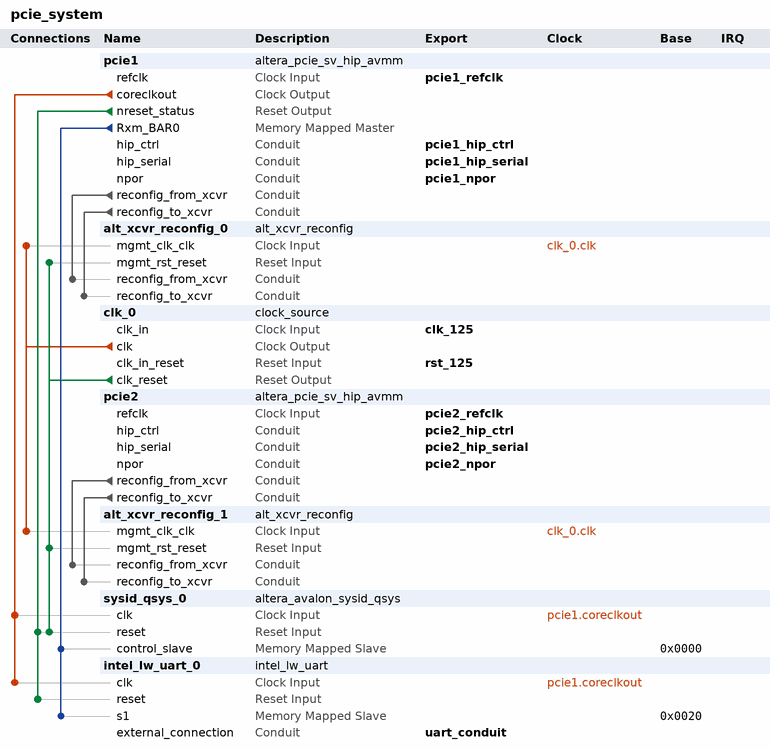
[diagram p0: system contents]
# Platform Designer (Qsys) system pcie_system, Stratix V 5SEE9F45C2
# Parameters at their usual value, and those the tool derives, are not listed.
package require -exact qsys 23.1
create_system pcie_system
set_project_property DEVICE_FAMILY {Stratix V}
set_project_property DEVICE 5SEE9F45C2

add_instance pcie1 altera_pcie_sv_hip_avmm 23.1
set_instance_parameter_value pcie1 AST_LITE 0
set_instance_parameter_value pcie1 AVALON_ADDR_WIDTH 32
set_instance_parameter_value pcie1 AddressPage "0\\,1\\,2\\,3\\,4\\,5\\,6\\,7\\,8\\,9\\,10\\,11\\,12\\,13\\,14\\,15"
set_instance_parameter_value pcie1 BYPASSS_A2P_TRANSLATION 0
set_instance_parameter_value pcie1 CB_A2P_ADDR_MAP_FIXED_TABLE_0_HIGH 0
set_instance_parameter_value pcie1 CB_A2P_ADDR_MAP_FIXED_TABLE_0_LOW 0
set_instance_parameter_value pcie1 CB_A2P_ADDR_MAP_FIXED_TABLE_10_HIGH 0
set_instance_parameter_value pcie1 CB_A2P_ADDR_MAP_FIXED_TABLE_10_LOW 0
set_instance_parameter_value pcie1 CB_A2P_ADDR_MAP_FIXED_TABLE_11_HIGH 0
set_instance_parameter_value pcie1 CB_A2P_ADDR_MAP_FIXED_TABLE_11_LOW 0
set_instance_parameter_value pcie1 CB_A2P_ADDR_MAP_FIXED_TABLE_12_HIGH 0
set_instance_parameter_value pcie1 CB_A2P_ADDR_MAP_FIXED_TABLE_12_LOW 0
set_instance_parameter_value pcie1 CB_A2P_ADDR_MAP_FIXED_TABLE_13_HIGH 0
set_instance_parameter_value pcie1 CB_A2P_ADDR_MAP_FIXED_TABLE_13_LOW 0
set_instance_parameter_value pcie1 CB_A2P_ADDR_MAP_FIXED_TABLE_14_HIGH 0
set_instance_parameter_value pcie1 CB_A2P_ADDR_MAP_FIXED_TABLE_14_LOW 0
set_instance_parameter_value pcie1 CB_A2P_ADDR_MAP_FIXED_TABLE_15_HIGH 0
set_instance_parameter_value pcie1 CB_A2P_ADDR_MAP_FIXED_TABLE_15_LOW 0
set_instance_parameter_value pcie1 CB_A2P_ADDR_MAP_FIXED_TABLE_1_HIGH 0
set_instance_parameter_value pcie1 CB_A2P_ADDR_MAP_FIXED_TABLE_1_LOW 0
set_instance_parameter_value pcie1 CB_A2P_ADDR_MAP_FIXED_TABLE_2_HIGH 0
set_instance_parameter_value pcie1 CB_A2P_ADDR_MAP_FIXED_TABLE_2_LOW 0
set_instance_parameter_value pcie1 CB_A2P_ADDR_MAP_FIXED_TABLE_3_HIGH 0
set_instance_parameter_value pcie1 CB_A2P_ADDR_MAP_FIXED_TABLE_3_LOW 0
set_instance_parameter_value pcie1 CB_A2P_ADDR_MAP_FIXED_TABLE_4_HIGH 0
set_instance_parameter_value pcie1 CB_A2P_ADDR_MAP_FIXED_TABLE_4_LOW 0
set_instance_parameter_value pcie1 CB_A2P_ADDR_MAP_FIXED_TABLE_5_HIGH 0
set_instance_parameter_value pcie1 CB_A2P_ADDR_MAP_FIXED_TABLE_5_LOW 0
set_instance_parameter_value pcie1 CB_A2P_ADDR_MAP_FIXED_TABLE_6_HIGH 0
set_instance_parameter_value pcie1 CB_A2P_ADDR_MAP_FIXED_TABLE_6_LOW 0
set_instance_parameter_value pcie1 CB_A2P_ADDR_MAP_FIXED_TABLE_7_HIGH 0
set_instance_parameter_value pcie1 CB_A2P_ADDR_MAP_FIXED_TABLE_7_LOW 0
set_instance_parameter_value pcie1 CB_A2P_ADDR_MAP_FIXED_TABLE_8_HIGH 0
set_instance_parameter_value pcie1 CB_A2P_ADDR_MAP_FIXED_TABLE_8_LOW 0
set_instance_parameter_value pcie1 CB_A2P_ADDR_MAP_FIXED_TABLE_9_HIGH 0
set_instance_parameter_value pcie1 CB_A2P_ADDR_MAP_FIXED_TABLE_9_LOW 0
set_instance_parameter_value pcie1 CB_A2P_ADDR_MAP_IS_FIXED 0
set_instance_parameter_value pcie1 CB_A2P_ADDR_MAP_NUM_ENTRIES 2
set_instance_parameter_value pcie1 CB_A2P_ADDR_MAP_PASS_THRU_BITS 20
set_instance_parameter_value pcie1 CB_P2A_AVALON_ADDR_B0 0x00000000
set_instance_parameter_value pcie1 CB_P2A_AVALON_ADDR_B1 0x00000000
set_instance_parameter_value pcie1 CB_P2A_AVALON_ADDR_B2 0x00000000
set_instance_parameter_value pcie1 CB_P2A_AVALON_ADDR_B3 0x00000000
set_instance_parameter_value pcie1 CB_P2A_AVALON_ADDR_B4 0x00000000
set_instance_parameter_value pcie1 CB_P2A_AVALON_ADDR_B5 0x00000000
set_instance_parameter_value pcie1 CB_P2A_FIXED_AVALON_ADDR_B0 0
set_instance_parameter_value pcie1 CB_P2A_FIXED_AVALON_ADDR_B1 0
set_instance_parameter_value pcie1 CB_P2A_FIXED_AVALON_ADDR_B2 0
set_instance_parameter_value pcie1 CB_P2A_FIXED_AVALON_ADDR_B3 0
set_instance_parameter_value pcie1 CB_P2A_FIXED_AVALON_ADDR_B4 0
set_instance_parameter_value pcie1 CB_P2A_FIXED_AVALON_ADDR_B5 0
set_instance_parameter_value pcie1 CB_PCIE_MODE 1
set_instance_parameter_value pcie1 CB_PCIE_RX_LITE 0
set_instance_parameter_value pcie1 CB_RP_S_ADDR_WIDTH 32
set_instance_parameter_value pcie1 CG_COMMON_CLOCK_MODE 1
set_instance_parameter_value pcie1 CG_ENABLE_A2P_INTERRUPT 0
set_instance_parameter_value pcie1 CG_ENABLE_ADVANCED_INTERRUPT 0
set_instance_parameter_value pcie1 CG_ENABLE_HIP_STATUS 1
set_instance_parameter_value pcie1 CG_ENABLE_HIP_STATUS_EXTENSION 0
set_instance_parameter_value pcie1 CG_IMPL_CRA_AV_SLAVE_PORT 0
set_instance_parameter_value pcie1 CG_RXM_IRQ_NUM 16
set_instance_parameter_value pcie1 NUM_PREFETCH_MASTERS 1
set_instance_parameter_value pcie1 PCIeAddress31_0 "0x00000000\\,0x00000000\\,0x00000000\\,0x00000000\\,0x00000000\\,0x00000000\\,0x00000000\\,0x00000000\\,0x00000000\\,0x00000000\\,0x00000000\\,0x00000000\\,0x00000000\\,0x00000000\\,0x00000000\\,0x00000000"
set_instance_parameter_value pcie1 PCIeAddress63_32 "0x00000000\\,0x00000000\\,0x00000000\\,0x00000000\\,0x00000000\\,0x00000000\\,0x00000000\\,0x00000000\\,0x00000000\\,0x00000000\\,0x00000000\\,0x00000000\\,0x00000000\\,0x00000000\\,0x00000000\\,0x00000000"
set_instance_parameter_value pcie1 RXM_BEN_WIDTH 8
set_instance_parameter_value pcie1 RXM_DATA_WIDTH 64
set_instance_parameter_value pcie1 SLAVE_ADDRESS_MAP_0 6
set_instance_parameter_value pcie1 SLAVE_ADDRESS_MAP_1 0
set_instance_parameter_value pcie1 SLAVE_ADDRESS_MAP_2 0
set_instance_parameter_value pcie1 SLAVE_ADDRESS_MAP_3 0
set_instance_parameter_value pcie1 SLAVE_ADDRESS_MAP_4 0
set_instance_parameter_value pcie1 SLAVE_ADDRESS_MAP_5 0
set_instance_parameter_value pcie1 TX_S_ADDR_WIDTH 32
set_instance_parameter_value pcie1 advanced_default_hwtcl_atomic_malformed true
set_instance_parameter_value pcie1 advanced_default_hwtcl_atomic_op_completer_32bit false
set_instance_parameter_value pcie1 advanced_default_hwtcl_atomic_op_completer_64bit false
set_instance_parameter_value pcie1 advanced_default_hwtcl_atomic_op_routing false
set_instance_parameter_value pcie1 advanced_default_hwtcl_bridge_port_ssid_support false
set_instance_parameter_value pcie1 advanced_default_hwtcl_bridge_port_vga_enable false
set_instance_parameter_value pcie1 advanced_default_hwtcl_bypass_cdc false
set_instance_parameter_value pcie1 advanced_default_hwtcl_cas_completer_128bit false
set_instance_parameter_value pcie1 advanced_default_hwtcl_cdc_dummy_insert_limit 11
set_instance_parameter_value pcie1 advanced_default_hwtcl_d0_pme false
set_instance_parameter_value pcie1 advanced_default_hwtcl_d1_pme false
set_instance_parameter_value pcie1 advanced_default_hwtcl_d1_support false
set_instance_parameter_value pcie1 advanced_default_hwtcl_d2_pme false
set_instance_parameter_value pcie1 advanced_default_hwtcl_d2_support false
set_instance_parameter_value pcie1 advanced_default_hwtcl_d3_cold_pme false
set_instance_parameter_value pcie1 advanced_default_hwtcl_d3_hot_pme false
set_instance_parameter_value pcie1 advanced_default_hwtcl_data_pack_rx disable
set_instance_parameter_value pcie1 advanced_default_hwtcl_deskew_comma com_deskw
set_instance_parameter_value pcie1 advanced_default_hwtcl_device_number 0
set_instance_parameter_value pcie1 advanced_default_hwtcl_disable_link_x2_support false
set_instance_parameter_value pcie1 advanced_default_hwtcl_disable_snoop_packet false
set_instance_parameter_value pcie1 advanced_default_hwtcl_ei_delay_powerdown_count 10
set_instance_parameter_value pcie1 advanced_default_hwtcl_eie_before_nfts_count 4
set_instance_parameter_value pcie1 advanced_default_hwtcl_enable_adapter_half_rate_mode false
set_instance_parameter_value pcie1 advanced_default_hwtcl_enable_l1_aspm false
set_instance_parameter_value pcie1 advanced_default_hwtcl_enable_rx_buffer_checking false
set_instance_parameter_value pcie1 advanced_default_hwtcl_extended_format_field false
set_instance_parameter_value pcie1 advanced_default_hwtcl_extended_tag_reset false
set_instance_parameter_value pcie1 advanced_default_hwtcl_fc_init_timer 1024
set_instance_parameter_value pcie1 advanced_default_hwtcl_flow_control_timeout_count 200
set_instance_parameter_value pcie1 advanced_default_hwtcl_flow_control_update_count 30
set_instance_parameter_value pcie1 advanced_default_hwtcl_flr_capability false
set_instance_parameter_value pcie1 advanced_default_hwtcl_gen2_diffclock_nfts_count 255
set_instance_parameter_value pcie1 advanced_default_hwtcl_gen2_sameclock_nfts_count 255
set_instance_parameter_value pcie1 advanced_default_hwtcl_hot_plug_support 0
set_instance_parameter_value pcie1 advanced_default_hwtcl_interrupt_pin inta
set_instance_parameter_value pcie1 advanced_default_hwtcl_l01_entry_latency 31
set_instance_parameter_value pcie1 advanced_default_hwtcl_l0_exit_latency_diffclock 6
set_instance_parameter_value pcie1 advanced_default_hwtcl_l0_exit_latency_sameclock 6
set_instance_parameter_value pcie1 advanced_default_hwtcl_l1_exit_latency_diffclock 0
set_instance_parameter_value pcie1 advanced_default_hwtcl_l1_exit_latency_sameclock 0
set_instance_parameter_value pcie1 advanced_default_hwtcl_low_priority_vc single_vc
set_instance_parameter_value pcie1 advanced_default_hwtcl_ltr_mechanism false
set_instance_parameter_value pcie1 advanced_default_hwtcl_ltssm_1ms_timeout disable
set_instance_parameter_value pcie1 advanced_default_hwtcl_ltssm_freqlocked_check disable
set_instance_parameter_value pcie1 advanced_default_hwtcl_maximum_current 0
set_instance_parameter_value pcie1 advanced_default_hwtcl_no_command_completed false
set_instance_parameter_value pcie1 advanced_default_hwtcl_no_soft_reset false
set_instance_parameter_value pcie1 advanced_default_hwtcl_pclk_out_sel pclk
set_instance_parameter_value pcie1 advanced_default_hwtcl_pipex1_debug_sel disable
set_instance_parameter_value pcie1 advanced_default_hwtcl_register_pipe_signals false
set_instance_parameter_value pcie1 advanced_default_hwtcl_reserved_debug 0
set_instance_parameter_value pcie1 advanced_default_hwtcl_retry_buffer_last_active_address 2047
set_instance_parameter_value pcie1 advanced_default_hwtcl_rx_l0s_count_idl 0
set_instance_parameter_value pcie1 advanced_default_hwtcl_set_l0s 0
set_instance_parameter_value pcie1 advanced_default_hwtcl_skp_os_gen3_count 0
set_instance_parameter_value pcie1 advanced_default_hwtcl_skp_os_schedule_count 0
set_instance_parameter_value pcie1 advanced_default_hwtcl_ssid 0
set_instance_parameter_value pcie1 advanced_default_hwtcl_ssvid 0
set_instance_parameter_value pcie1 advanced_default_hwtcl_tph_completer false
set_instance_parameter_value pcie1 advanced_default_hwtcl_tx_cdc_almost_empty 5
set_instance_parameter_value pcie1 advanced_default_hwtcl_vc0_clk_enable true
set_instance_parameter_value pcie1 advanced_default_hwtcl_wrong_device_id disable
set_instance_parameter_value pcie1 advanced_default_parameter_override 0
set_instance_parameter_value pcie1 avmm_width_hwtcl 128
set_instance_parameter_value pcie1 bar0_type_hwtcl 2
set_instance_parameter_value pcie1 bar1_type_hwtcl 0
set_instance_parameter_value pcie1 bar2_type_hwtcl 0
set_instance_parameter_value pcie1 bar3_type_hwtcl 0
set_instance_parameter_value pcie1 bar4_type_hwtcl 0
set_instance_parameter_value pcie1 bar5_type_hwtcl 0
set_instance_parameter_value pcie1 bypass_tl false
set_instance_parameter_value pcie1 class_code_hwtcl 0
set_instance_parameter_value pcie1 completion_timeout_hwtcl ABCD
set_instance_parameter_value pcie1 device_id_hwtcl 167
set_instance_parameter_value pcie1 dll_active_report_support_hwtcl 0
set_instance_parameter_value pcie1 ecrc_check_capable_hwtcl 0
set_instance_parameter_value pcie1 ecrc_gen_capable_hwtcl 0
set_instance_parameter_value pcie1 enable_completion_timeout_disable_hwtcl 1
set_instance_parameter_value pcie1 enable_function_msix_support_hwtcl 0
set_instance_parameter_value pcie1 enable_pcisigtest_hwtcl 0
set_instance_parameter_value pcie1 enable_power_on_rst_pulse_hwtcl 0
set_instance_parameter_value pcie1 enable_slot_register_hwtcl 0
set_instance_parameter_value pcie1 enable_tl_only_sim_hwtcl 0
set_instance_parameter_value pcie1 endpoint_l0_latency_hwtcl 0
set_instance_parameter_value pcie1 endpoint_l1_latency_hwtcl 0
set_instance_parameter_value pcie1 expansion_base_address_register_hwtcl 0
set_instance_parameter_value pcie1 extend_tag_field_hwtcl 32
set_instance_parameter_value pcie1 fixed_address_mode 0
set_instance_parameter_value pcie1 force_hrc 0
set_instance_parameter_value pcie1 force_src 0
set_instance_parameter_value pcie1 gen123_lane_rate_mode_hwtcl {Gen2 (5.0 Gbps)}
set_instance_parameter_value pcie1 gen3_rxfreqlock_counter_hwtcl 0
set_instance_parameter_value pcie1 hip_reconfig_hwtcl 0
set_instance_parameter_value pcie1 hip_tag_checking_hwtcl 1
set_instance_parameter_value pcie1 hwtcl_override_g2_txvod 1
set_instance_parameter_value pcie1 in_cvp_mode_hwtcl 0
set_instance_parameter_value pcie1 io_window_addr_width_hwtcl 0
set_instance_parameter_value pcie1 lane_mask_hwtcl x8
set_instance_parameter_value pcie1 max_payload_size_hwtcl 128
set_instance_parameter_value pcie1 msi_64bit_addressing_capable_hwtcl true
set_instance_parameter_value pcie1 msi_masking_capable_hwtcl false
set_instance_parameter_value pcie1 msi_multi_message_capable_hwtcl 4
set_instance_parameter_value pcie1 msi_support_hwtcl true
set_instance_parameter_value pcie1 msix_pba_bir_hwtcl 0
set_instance_parameter_value pcie1 msix_pba_offset_hwtcl 0
set_instance_parameter_value pcie1 msix_table_bir_hwtcl 0
set_instance_parameter_value pcie1 msix_table_offset_hwtcl 0
set_instance_parameter_value pcie1 msix_table_size_hwtcl 0
set_instance_parameter_value pcie1 override_rxbuffer_cred_preset 0
set_instance_parameter_value pcie1 override_tbpartner_driver_setting_hwtcl 0
set_instance_parameter_value pcie1 pcie_inspector_hwtcl 0
set_instance_parameter_value pcie1 pcie_qsys 1
set_instance_parameter_value pcie1 pll_refclk_freq_hwtcl {100 MHz}
set_instance_parameter_value pcie1 port_link_number_hwtcl 1
set_instance_parameter_value pcie1 port_type_hwtcl {Native endpoint}
set_instance_parameter_value pcie1 prefetchable_mem_window_addr_width_hwtcl 0
set_instance_parameter_value pcie1 revision_id_hwtcl 1
set_instance_parameter_value pcie1 rpre_emph_a_val_hwtcl 9
set_instance_parameter_value pcie1 rpre_emph_b_val_hwtcl 0
set_instance_parameter_value pcie1 rpre_emph_c_val_hwtcl 16
set_instance_parameter_value pcie1 rpre_emph_d_val_hwtcl 13
set_instance_parameter_value pcie1 rpre_emph_e_val_hwtcl 5
set_instance_parameter_value pcie1 rvod_sel_a_val_hwtcl 42
set_instance_parameter_value pcie1 rvod_sel_b_val_hwtcl 38
set_instance_parameter_value pcie1 rvod_sel_c_val_hwtcl 38
set_instance_parameter_value pcie1 rvod_sel_d_val_hwtcl 43
set_instance_parameter_value pcie1 rvod_sel_e_val_hwtcl 15
set_instance_parameter_value pcie1 rxbuffer_rxreq_hwtcl Low
set_instance_parameter_value pcie1 serial_sim_hwtcl 1
set_instance_parameter_value pcie1 set_pld_clk_x1_625MHz_hwtcl 0
set_instance_parameter_value pcie1 slot_number_hwtcl 0
set_instance_parameter_value pcie1 slot_power_limit_hwtcl 0
set_instance_parameter_value pcie1 slot_power_scale_hwtcl 0
set_instance_parameter_value pcie1 slotclkcfg_hwtcl 1
set_instance_parameter_value pcie1 subsystem_device_id_hwtcl 1
set_instance_parameter_value pcie1 subsystem_vendor_id_hwtcl 418
set_instance_parameter_value pcie1 surprise_down_error_support_hwtcl 0
set_instance_parameter_value pcie1 tlp_insp_trg_dw0_hwtcl 2049
set_instance_parameter_value pcie1 tlp_insp_trg_dw1_hwtcl 0
set_instance_parameter_value pcie1 tlp_insp_trg_dw2_hwtcl 0
set_instance_parameter_value pcie1 tlp_insp_trg_dw3_hwtcl 0
set_instance_parameter_value pcie1 tlp_inspector_hwtcl 0
set_instance_parameter_value pcie1 tlp_inspector_use_signal_probe_hwtcl 0
set_instance_parameter_value pcie1 use_aer_hwtcl 0
set_instance_parameter_value pcie1 use_ast_parity 0
set_instance_parameter_value pcie1 use_atx_pll_hwtcl 0
set_instance_parameter_value pcie1 use_crc_forwarding_hwtcl 0
set_instance_parameter_value pcie1 use_cvp_update_core_pof_hwtcl 0
set_instance_parameter_value pcie1 use_rx_st_be_hwtcl 0
set_instance_parameter_value pcie1 user_id_hwtcl 0
set_instance_parameter_value pcie1 vendor_id_hwtcl 4466
set_instance_parameter_value pcie1 vsec_id_hwtcl 4466
set_instance_parameter_value pcie1 vsec_rev_hwtcl 0

add_instance alt_xcvr_reconfig_0 alt_xcvr_reconfig 19.1
set_instance_parameter_value alt_xcvr_reconfig_0 device_family {Stratix V}
set_instance_parameter_value alt_xcvr_reconfig_0 enable_adce 0
set_instance_parameter_value alt_xcvr_reconfig_0 enable_analog 1
set_instance_parameter_value alt_xcvr_reconfig_0 number_of_reconfig_interfaces 10

add_instance clk_0 clock_source 23.1
set_instance_parameter_value clk_0 clockFrequency 125000000

add_instance pcie2 altera_pcie_sv_hip_avmm 23.1
set_instance_parameter_value pcie2 AST_LITE 0
set_instance_parameter_value pcie2 AVALON_ADDR_WIDTH 32
set_instance_parameter_value pcie2 AddressPage "0\\,1\\,2\\,3\\,4\\,5\\,6\\,7\\,8\\,9\\,10\\,11\\,12\\,13\\,14\\,15"
set_instance_parameter_value pcie2 BYPASSS_A2P_TRANSLATION 0
set_instance_parameter_value pcie2 CB_A2P_ADDR_MAP_FIXED_TABLE_0_HIGH 0
set_instance_parameter_value pcie2 CB_A2P_ADDR_MAP_FIXED_TABLE_0_LOW 0
set_instance_parameter_value pcie2 CB_A2P_ADDR_MAP_FIXED_TABLE_10_HIGH 0
set_instance_parameter_value pcie2 CB_A2P_ADDR_MAP_FIXED_TABLE_10_LOW 0
set_instance_parameter_value pcie2 CB_A2P_ADDR_MAP_FIXED_TABLE_11_HIGH 0
set_instance_parameter_value pcie2 CB_A2P_ADDR_MAP_FIXED_TABLE_11_LOW 0
set_instance_parameter_value pcie2 CB_A2P_ADDR_MAP_FIXED_TABLE_12_HIGH 0
set_instance_parameter_value pcie2 CB_A2P_ADDR_MAP_FIXED_TABLE_12_LOW 0
set_instance_parameter_value pcie2 CB_A2P_ADDR_MAP_FIXED_TABLE_13_HIGH 0
set_instance_parameter_value pcie2 CB_A2P_ADDR_MAP_FIXED_TABLE_13_LOW 0
set_instance_parameter_value pcie2 CB_A2P_ADDR_MAP_FIXED_TABLE_14_HIGH 0
set_instance_parameter_value pcie2 CB_A2P_ADDR_MAP_FIXED_TABLE_14_LOW 0
set_instance_parameter_value pcie2 CB_A2P_ADDR_MAP_FIXED_TABLE_15_HIGH 0
set_instance_parameter_value pcie2 CB_A2P_ADDR_MAP_FIXED_TABLE_15_LOW 0
set_instance_parameter_value pcie2 CB_A2P_ADDR_MAP_FIXED_TABLE_1_HIGH 0
set_instance_parameter_value pcie2 CB_A2P_ADDR_MAP_FIXED_TABLE_1_LOW 0
set_instance_parameter_value pcie2 CB_A2P_ADDR_MAP_FIXED_TABLE_2_HIGH 0
set_instance_parameter_value pcie2 CB_A2P_ADDR_MAP_FIXED_TABLE_2_LOW 0
set_instance_parameter_value pcie2 CB_A2P_ADDR_MAP_FIXED_TABLE_3_HIGH 0
set_instance_parameter_value pcie2 CB_A2P_ADDR_MAP_FIXED_TABLE_3_LOW 0
set_instance_parameter_value pcie2 CB_A2P_ADDR_MAP_FIXED_TABLE_4_HIGH 0
set_instance_parameter_value pcie2 CB_A2P_ADDR_MAP_FIXED_TABLE_4_LOW 0
set_instance_parameter_value pcie2 CB_A2P_ADDR_MAP_FIXED_TABLE_5_HIGH 0
set_instance_parameter_value pcie2 CB_A2P_ADDR_MAP_FIXED_TABLE_5_LOW 0
set_instance_parameter_value pcie2 CB_A2P_ADDR_MAP_FIXED_TABLE_6_HIGH 0
set_instance_parameter_value pcie2 CB_A2P_ADDR_MAP_FIXED_TABLE_6_LOW 0
set_instance_parameter_value pcie2 CB_A2P_ADDR_MAP_FIXED_TABLE_7_HIGH 0
set_instance_parameter_value pcie2 CB_A2P_ADDR_MAP_FIXED_TABLE_7_LOW 0
set_instance_parameter_value pcie2 CB_A2P_ADDR_MAP_FIXED_TABLE_8_HIGH 0
set_instance_parameter_value pcie2 CB_A2P_ADDR_MAP_FIXED_TABLE_8_LOW 0
set_instance_parameter_value pcie2 CB_A2P_ADDR_MAP_FIXED_TABLE_9_HIGH 0
set_instance_parameter_value pcie2 CB_A2P_ADDR_MAP_FIXED_TABLE_9_LOW 0
set_instance_parameter_value pcie2 CB_A2P_ADDR_MAP_IS_FIXED 0
set_instance_parameter_value pcie2 CB_A2P_ADDR_MAP_NUM_ENTRIES 2
set_instance_parameter_value pcie2 CB_A2P_ADDR_MAP_PASS_THRU_BITS 20
set_instance_parameter_value pcie2 CB_P2A_AVALON_ADDR_B0 0x00000000
set_instance_parameter_value pcie2 CB_P2A_AVALON_ADDR_B1 0x00000000
set_instance_parameter_value pcie2 CB_P2A_AVALON_ADDR_B2 0x00000000
set_instance_parameter_value pcie2 CB_P2A_AVALON_ADDR_B3 0x00000000
set_instance_parameter_value pcie2 CB_P2A_AVALON_ADDR_B4 0x00000000
set_instance_parameter_value pcie2 CB_P2A_AVALON_ADDR_B5 0x00000000
set_instance_parameter_value pcie2 CB_P2A_FIXED_AVALON_ADDR_B0 0
set_instance_parameter_value pcie2 CB_P2A_FIXED_AVALON_ADDR_B1 0
set_instance_parameter_value pcie2 CB_P2A_FIXED_AVALON_ADDR_B2 0
set_instance_parameter_value pcie2 CB_P2A_FIXED_AVALON_ADDR_B3 0
set_instance_parameter_value pcie2 CB_P2A_FIXED_AVALON_ADDR_B4 0
set_instance_parameter_value pcie2 CB_P2A_FIXED_AVALON_ADDR_B5 0
set_instance_parameter_value pcie2 CB_PCIE_MODE 1
set_instance_parameter_value pcie2 CB_PCIE_RX_LITE 0
set_instance_parameter_value pcie2 CB_RP_S_ADDR_WIDTH 32
set_instance_parameter_value pcie2 CG_COMMON_CLOCK_MODE 1
set_instance_parameter_value pcie2 CG_ENABLE_A2P_INTERRUPT 0
set_instance_parameter_value pcie2 CG_ENABLE_ADVANCED_INTERRUPT 0
set_instance_parameter_value pcie2 CG_ENABLE_HIP_STATUS 1
set_instance_parameter_value pcie2 CG_ENABLE_HIP_STATUS_EXTENSION 0
set_instance_parameter_value pcie2 CG_IMPL_CRA_AV_SLAVE_PORT 0
set_instance_parameter_value pcie2 CG_RXM_IRQ_NUM 16
set_instance_parameter_value pcie2 NUM_PREFETCH_MASTERS 1
set_instance_parameter_value pcie2 PCIeAddress31_0 "0x00000000\\,0x00000000\\,0x00000000\\,0x00000000\\,0x00000000\\,0x00000000\\,0x00000000\\,0x00000000\\,0x00000000\\,0x00000000\\,0x00000000\\,0x00000000\\,0x00000000\\,0x00000000\\,0x00000000\\,0x00000000"
set_instance_parameter_value pcie2 PCIeAddress63_32 "0x00000000\\,0x00000000\\,0x00000000\\,0x00000000\\,0x00000000\\,0x00000000\\,0x00000000\\,0x00000000\\,0x00000000\\,0x00000000\\,0x00000000\\,0x00000000\\,0x00000000\\,0x00000000\\,0x00000000\\,0x00000000"
set_instance_parameter_value pcie2 RXM_BEN_WIDTH 8
set_instance_parameter_value pcie2 RXM_DATA_WIDTH 64
set_instance_parameter_value pcie2 SLAVE_ADDRESS_MAP_0 0
set_instance_parameter_value pcie2 SLAVE_ADDRESS_MAP_1 0
set_instance_parameter_value pcie2 SLAVE_ADDRESS_MAP_2 0
set_instance_parameter_value pcie2 SLAVE_ADDRESS_MAP_3 0
set_instance_parameter_value pcie2 SLAVE_ADDRESS_MAP_4 0
set_instance_parameter_value pcie2 SLAVE_ADDRESS_MAP_5 0
set_instance_parameter_value pcie2 TX_S_ADDR_WIDTH 32
set_instance_parameter_value pcie2 advanced_default_hwtcl_atomic_malformed true
set_instance_parameter_value pcie2 advanced_default_hwtcl_atomic_op_completer_32bit false
set_instance_parameter_value pcie2 advanced_default_hwtcl_atomic_op_completer_64bit false
set_instance_parameter_value pcie2 advanced_default_hwtcl_atomic_op_routing false
set_instance_parameter_value pcie2 advanced_default_hwtcl_bridge_port_ssid_support false
set_instance_parameter_value pcie2 advanced_default_hwtcl_bridge_port_vga_enable false
set_instance_parameter_value pcie2 advanced_default_hwtcl_bypass_cdc false
set_instance_parameter_value pcie2 advanced_default_hwtcl_cas_completer_128bit false
set_instance_parameter_value pcie2 advanced_default_hwtcl_cdc_dummy_insert_limit 11
set_instance_parameter_value pcie2 advanced_default_hwtcl_d0_pme false
set_instance_parameter_value pcie2 advanced_default_hwtcl_d1_pme false
set_instance_parameter_value pcie2 advanced_default_hwtcl_d1_support false
set_instance_parameter_value pcie2 advanced_default_hwtcl_d2_pme false
set_instance_parameter_value pcie2 advanced_default_hwtcl_d2_support false
set_instance_parameter_value pcie2 advanced_default_hwtcl_d3_cold_pme false
set_instance_parameter_value pcie2 advanced_default_hwtcl_d3_hot_pme false
set_instance_parameter_value pcie2 advanced_default_hwtcl_data_pack_rx disable
set_instance_parameter_value pcie2 advanced_default_hwtcl_deskew_comma com_deskw
set_instance_parameter_value pcie2 advanced_default_hwtcl_device_number 0
set_instance_parameter_value pcie2 advanced_default_hwtcl_disable_link_x2_support false
set_instance_parameter_value pcie2 advanced_default_hwtcl_disable_snoop_packet false
set_instance_parameter_value pcie2 advanced_default_hwtcl_ei_delay_powerdown_count 10
set_instance_parameter_value pcie2 advanced_default_hwtcl_eie_before_nfts_count 4
set_instance_parameter_value pcie2 advanced_default_hwtcl_enable_adapter_half_rate_mode false
set_instance_parameter_value pcie2 advanced_default_hwtcl_enable_l1_aspm false
set_instance_parameter_value pcie2 advanced_default_hwtcl_enable_rx_buffer_checking false
set_instance_parameter_value pcie2 advanced_default_hwtcl_extended_format_field false
set_instance_parameter_value pcie2 advanced_default_hwtcl_extended_tag_reset false
set_instance_parameter_value pcie2 advanced_default_hwtcl_fc_init_timer 1024
set_instance_parameter_value pcie2 advanced_default_hwtcl_flow_control_timeout_count 200
set_instance_parameter_value pcie2 advanced_default_hwtcl_flow_control_update_count 30
set_instance_parameter_value pcie2 advanced_default_hwtcl_flr_capability false
set_instance_parameter_value pcie2 advanced_default_hwtcl_gen2_diffclock_nfts_count 255
set_instance_parameter_value pcie2 advanced_default_hwtcl_gen2_sameclock_nfts_count 255
set_instance_parameter_value pcie2 advanced_default_hwtcl_hot_plug_support 0
set_instance_parameter_value pcie2 advanced_default_hwtcl_interrupt_pin inta
set_instance_parameter_value pcie2 advanced_default_hwtcl_l01_entry_latency 31
set_instance_parameter_value pcie2 advanced_default_hwtcl_l0_exit_latency_diffclock 6
set_instance_parameter_value pcie2 advanced_default_hwtcl_l0_exit_latency_sameclock 6
set_instance_parameter_value pcie2 advanced_default_hwtcl_l1_exit_latency_diffclock 0
set_instance_parameter_value pcie2 advanced_default_hwtcl_l1_exit_latency_sameclock 0
set_instance_parameter_value pcie2 advanced_default_hwtcl_low_priority_vc single_vc
set_instance_parameter_value pcie2 advanced_default_hwtcl_ltr_mechanism false
set_instance_parameter_value pcie2 advanced_default_hwtcl_ltssm_1ms_timeout disable
set_instance_parameter_value pcie2 advanced_default_hwtcl_ltssm_freqlocked_check disable
set_instance_parameter_value pcie2 advanced_default_hwtcl_maximum_current 0
set_instance_parameter_value pcie2 advanced_default_hwtcl_no_command_completed false
set_instance_parameter_value pcie2 advanced_default_hwtcl_no_soft_reset false
set_instance_parameter_value pcie2 advanced_default_hwtcl_pclk_out_sel pclk
set_instance_parameter_value pcie2 advanced_default_hwtcl_pipex1_debug_sel disable
set_instance_parameter_value pcie2 advanced_default_hwtcl_register_pipe_signals false
set_instance_parameter_value pcie2 advanced_default_hwtcl_reserved_debug 0
set_instance_parameter_value pcie2 advanced_default_hwtcl_retry_buffer_last_active_address 2047
set_instance_parameter_value pcie2 advanced_default_hwtcl_rx_l0s_count_idl 0
set_instance_parameter_value pcie2 advanced_default_hwtcl_set_l0s 0
set_instance_parameter_value pcie2 advanced_default_hwtcl_skp_os_gen3_count 0
set_instance_parameter_value pcie2 advanced_default_hwtcl_skp_os_schedule_count 0
set_instance_parameter_value pcie2 advanced_default_hwtcl_ssid 0
set_instance_parameter_value pcie2 advanced_default_hwtcl_ssvid 0
set_instance_parameter_value pcie2 advanced_default_hwtcl_tph_completer false
set_instance_parameter_value pcie2 advanced_default_hwtcl_tx_cdc_almost_empty 5
set_instance_parameter_value pcie2 advanced_default_hwtcl_vc0_clk_enable true
set_instance_parameter_value pcie2 advanced_default_hwtcl_wrong_device_id disable
set_instance_parameter_value pcie2 advanced_default_parameter_override 0
set_instance_parameter_value pcie2 avmm_width_hwtcl 128
set_instance_parameter_value pcie2 bar0_type_hwtcl 2
set_instance_parameter_value pcie2 bar1_type_hwtcl 0
set_instance_parameter_value pcie2 bar2_type_hwtcl 0
set_instance_parameter_value pcie2 bar3_type_hwtcl 0
set_instance_parameter_value pcie2 bar4_type_hwtcl 0
set_instance_parameter_value pcie2 bar5_type_hwtcl 0
set_instance_parameter_value pcie2 bypass_tl false
set_instance_parameter_value pcie2 class_code_hwtcl 0
set_instance_parameter_value pcie2 completion_timeout_hwtcl ABCD
set_instance_parameter_value pcie2 device_id_hwtcl 167
set_instance_parameter_value pcie2 dll_active_report_support_hwtcl 0
set_instance_parameter_value pcie2 ecrc_check_capable_hwtcl 0
set_instance_parameter_value pcie2 ecrc_gen_capable_hwtcl 0
set_instance_parameter_value pcie2 enable_completion_timeout_disable_hwtcl 1
set_instance_parameter_value pcie2 enable_function_msix_support_hwtcl 0
set_instance_parameter_value pcie2 enable_pcisigtest_hwtcl 0
set_instance_parameter_value pcie2 enable_power_on_rst_pulse_hwtcl 0
set_instance_parameter_value pcie2 enable_slot_register_hwtcl 0
set_instance_parameter_value pcie2 enable_tl_only_sim_hwtcl 0
set_instance_parameter_value pcie2 endpoint_l0_latency_hwtcl 0
set_instance_parameter_value pcie2 endpoint_l1_latency_hwtcl 0
set_instance_parameter_value pcie2 expansion_base_address_register_hwtcl 0
set_instance_parameter_value pcie2 extend_tag_field_hwtcl 32
set_instance_parameter_value pcie2 fixed_address_mode 0
set_instance_parameter_value pcie2 force_hrc 0
set_instance_parameter_value pcie2 force_src 0
set_instance_parameter_value pcie2 gen123_lane_rate_mode_hwtcl {Gen2 (5.0 Gbps)}
set_instance_parameter_value pcie2 gen3_rxfreqlock_counter_hwtcl 0
set_instance_parameter_value pcie2 hip_reconfig_hwtcl 0
set_instance_parameter_value pcie2 hip_tag_checking_hwtcl 1
set_instance_parameter_value pcie2 hwtcl_override_g2_txvod 1
set_instance_parameter_value pcie2 in_cvp_mode_hwtcl 0
set_instance_parameter_value pcie2 io_window_addr_width_hwtcl 0
set_instance_parameter_value pcie2 lane_mask_hwtcl x8
set_instance_parameter_value pcie2 max_payload_size_hwtcl 128
set_instance_parameter_value pcie2 msi_64bit_addressing_capable_hwtcl true
set_instance_parameter_value pcie2 msi_masking_capable_hwtcl false
set_instance_parameter_value pcie2 msi_multi_message_capable_hwtcl 4
set_instance_parameter_value pcie2 msi_support_hwtcl true
set_instance_parameter_value pcie2 msix_pba_bir_hwtcl 0
set_instance_parameter_value pcie2 msix_pba_offset_hwtcl 0
set_instance_parameter_value pcie2 msix_table_bir_hwtcl 0
set_instance_parameter_value pcie2 msix_table_offset_hwtcl 0
set_instance_parameter_value pcie2 msix_table_size_hwtcl 0
set_instance_parameter_value pcie2 override_rxbuffer_cred_preset 0
set_instance_parameter_value pcie2 override_tbpartner_driver_setting_hwtcl 0
set_instance_parameter_value pcie2 pcie_inspector_hwtcl 0
set_instance_parameter_value pcie2 pcie_qsys 1
set_instance_parameter_value pcie2 pll_refclk_freq_hwtcl {100 MHz}
set_instance_parameter_value pcie2 port_link_number_hwtcl 1
set_instance_parameter_value pcie2 port_type_hwtcl {Native endpoint}
set_instance_parameter_value pcie2 prefetchable_mem_window_addr_width_hwtcl 0
set_instance_parameter_value pcie2 revision_id_hwtcl 1
set_instance_parameter_value pcie2 rpre_emph_a_val_hwtcl 9
set_instance_parameter_value pcie2 rpre_emph_b_val_hwtcl 0
set_instance_parameter_value pcie2 rpre_emph_c_val_hwtcl 16
set_instance_parameter_value pcie2 rpre_emph_d_val_hwtcl 13
set_instance_parameter_value pcie2 rpre_emph_e_val_hwtcl 5
set_instance_parameter_value pcie2 rvod_sel_a_val_hwtcl 42
set_instance_parameter_value pcie2 rvod_sel_b_val_hwtcl 38
set_instance_parameter_value pcie2 rvod_sel_c_val_hwtcl 38
set_instance_parameter_value pcie2 rvod_sel_d_val_hwtcl 43
set_instance_parameter_value pcie2 rvod_sel_e_val_hwtcl 15
set_instance_parameter_value pcie2 rxbuffer_rxreq_hwtcl Low
set_instance_parameter_value pcie2 serial_sim_hwtcl 1
set_instance_parameter_value pcie2 set_pld_clk_x1_625MHz_hwtcl 0
set_instance_parameter_value pcie2 slot_number_hwtcl 0
set_instance_parameter_value pcie2 slot_power_limit_hwtcl 0
set_instance_parameter_value pcie2 slot_power_scale_hwtcl 0
set_instance_parameter_value pcie2 slotclkcfg_hwtcl 1
set_instance_parameter_value pcie2 subsystem_device_id_hwtcl 0
set_instance_parameter_value pcie2 subsystem_vendor_id_hwtcl 418
set_instance_parameter_value pcie2 surprise_down_error_support_hwtcl 0
set_instance_parameter_value pcie2 tlp_insp_trg_dw0_hwtcl 2049
set_instance_parameter_value pcie2 tlp_insp_trg_dw1_hwtcl 0
set_instance_parameter_value pcie2 tlp_insp_trg_dw2_hwtcl 0
set_instance_parameter_value pcie2 tlp_insp_trg_dw3_hwtcl 0
set_instance_parameter_value pcie2 tlp_inspector_hwtcl 0
set_instance_parameter_value pcie2 tlp_inspector_use_signal_probe_hwtcl 0
set_instance_parameter_value pcie2 use_aer_hwtcl 0
set_instance_parameter_value pcie2 use_ast_parity 0
set_instance_parameter_value pcie2 use_atx_pll_hwtcl 0
set_instance_parameter_value pcie2 use_crc_forwarding_hwtcl 0
set_instance_parameter_value pcie2 use_cvp_update_core_pof_hwtcl 0
set_instance_parameter_value pcie2 use_rx_st_be_hwtcl 0
set_instance_parameter_value pcie2 user_id_hwtcl 0
set_instance_parameter_value pcie2 vendor_id_hwtcl 4466
set_instance_parameter_value pcie2 vsec_id_hwtcl 4466
set_instance_parameter_value pcie2 vsec_rev_hwtcl 0

add_instance alt_xcvr_reconfig_1 alt_xcvr_reconfig 19.1
set_instance_parameter_value alt_xcvr_reconfig_1 device_family {Stratix V}
set_instance_parameter_value alt_xcvr_reconfig_1 enable_adce 0
set_instance_parameter_value alt_xcvr_reconfig_1 enable_analog 1
set_instance_parameter_value alt_xcvr_reconfig_1 number_of_reconfig_interfaces 10

add_instance sysid_qsys_0 altera_avalon_sysid_qsys 23.1
set_instance_parameter_value sysid_qsys_0 id 27394049

add_instance intel_lw_uart_0 intel_lw_uart 23.1
set_instance_parameter_value intel_lw_uart_0 baud 115200
set_instance_parameter_value intel_lw_uart_0 dataBits 8
set_instance_parameter_value intel_lw_uart_0 fixedBaud true
set_instance_parameter_value intel_lw_uart_0 parity NONE
set_instance_parameter_value intel_lw_uart_0 rxfifoAlmostFullValue 1
set_instance_parameter_value intel_lw_uart_0 rxfifoDepth 8
set_instance_parameter_value intel_lw_uart_0 simTrueBaud false
set_instance_parameter_value intel_lw_uart_0 stopBits 1
set_instance_parameter_value intel_lw_uart_0 syncRegDepth 2
set_instance_parameter_value intel_lw_uart_0 txfifoDepth 8
set_instance_parameter_value intel_lw_uart_0 useCtsRts false
set_instance_parameter_value intel_lw_uart_0 useEopRegister false
set_instance_parameter_value intel_lw_uart_0 useRegRXFIFO false
set_instance_parameter_value intel_lw_uart_0 useRegTXFIFO false

# connections
add_connection clk_0.clk alt_xcvr_reconfig_0.mgmt_clk_clk clock
add_connection clk_0.clk alt_xcvr_reconfig_1.mgmt_clk_clk clock
add_connection pcie1.coreclkout intel_lw_uart_0.clk clock
add_connection pcie1.coreclkout sysid_qsys_0.clk clock
add_connection clk_0.clk_reset alt_xcvr_reconfig_0.mgmt_rst_reset reset
add_connection clk_0.clk_reset alt_xcvr_reconfig_1.mgmt_rst_reset reset
add_connection clk_0.clk_reset sysid_qsys_0.reset reset
add_connection pcie1.nreset_status intel_lw_uart_0.reset reset
add_connection pcie1.nreset_status sysid_qsys_0.reset reset
add_connection pcie1.Rxm_BAR0 intel_lw_uart_0.s1 avalon
set_connection_parameter_value pcie1.Rxm_BAR0/intel_lw_uart_0.s1 baseAddress 0x0020
add_connection pcie1.Rxm_BAR0 sysid_qsys_0.control_slave avalon
set_connection_parameter_value pcie1.Rxm_BAR0/sysid_qsys_0.control_slave baseAddress 0x0000
add_connection pcie1.reconfig_from_xcvr alt_xcvr_reconfig_0.reconfig_from_xcvr conduit
add_connection pcie1.reconfig_to_xcvr alt_xcvr_reconfig_0.reconfig_to_xcvr conduit
add_connection pcie2.reconfig_from_xcvr alt_xcvr_reconfig_1.reconfig_from_xcvr conduit
add_connection pcie2.reconfig_to_xcvr alt_xcvr_reconfig_1.reconfig_to_xcvr conduit

# exported interfaces
add_interface clk_125 clock sink
set_interface_property clk_125 EXPORT_OF clk_0.clk_in
add_interface pcie1_hip_ctrl conduit end
set_interface_property pcie1_hip_ctrl EXPORT_OF pcie1.hip_ctrl
add_interface pcie1_hip_serial conduit end
set_interface_property pcie1_hip_serial EXPORT_OF pcie1.hip_serial
add_interface pcie1_npor conduit end
set_interface_property pcie1_npor EXPORT_OF pcie1.npor
add_interface pcie1_refclk clock sink
set_interface_property pcie1_refclk EXPORT_OF pcie1.refclk
add_interface pcie2_hip_ctrl conduit end
set_interface_property pcie2_hip_ctrl EXPORT_OF pcie2.hip_ctrl
add_interface pcie2_hip_serial conduit end
set_interface_property pcie2_hip_serial EXPORT_OF pcie2.hip_serial
add_interface pcie2_npor conduit end
set_interface_property pcie2_npor EXPORT_OF pcie2.npor
add_interface pcie2_refclk clock sink
set_interface_property pcie2_refclk EXPORT_OF pcie2.refclk
add_interface rst_125 reset sink
set_interface_property rst_125 EXPORT_OF clk_0.clk_in_reset
add_interface uart_conduit conduit end
set_interface_property uart_conduit EXPORT_OF intel_lw_uart_0.external_connection

set_interconnect_requirement {$system} qsys_mm.clockCrossingAdapter HANDSHAKE
set_interconnect_requirement {$system} qsys_mm.enableEccProtection FALSE
set_interconnect_requirement {$system} qsys_mm.insertDefaultSlave FALSE
set_interconnect_requirement {$system} qsys_mm.maxAdditionalLatency 1

save_system pcie_system.qsys
